# EAGLE design Hat V1 (EAGLE 9.3.2)
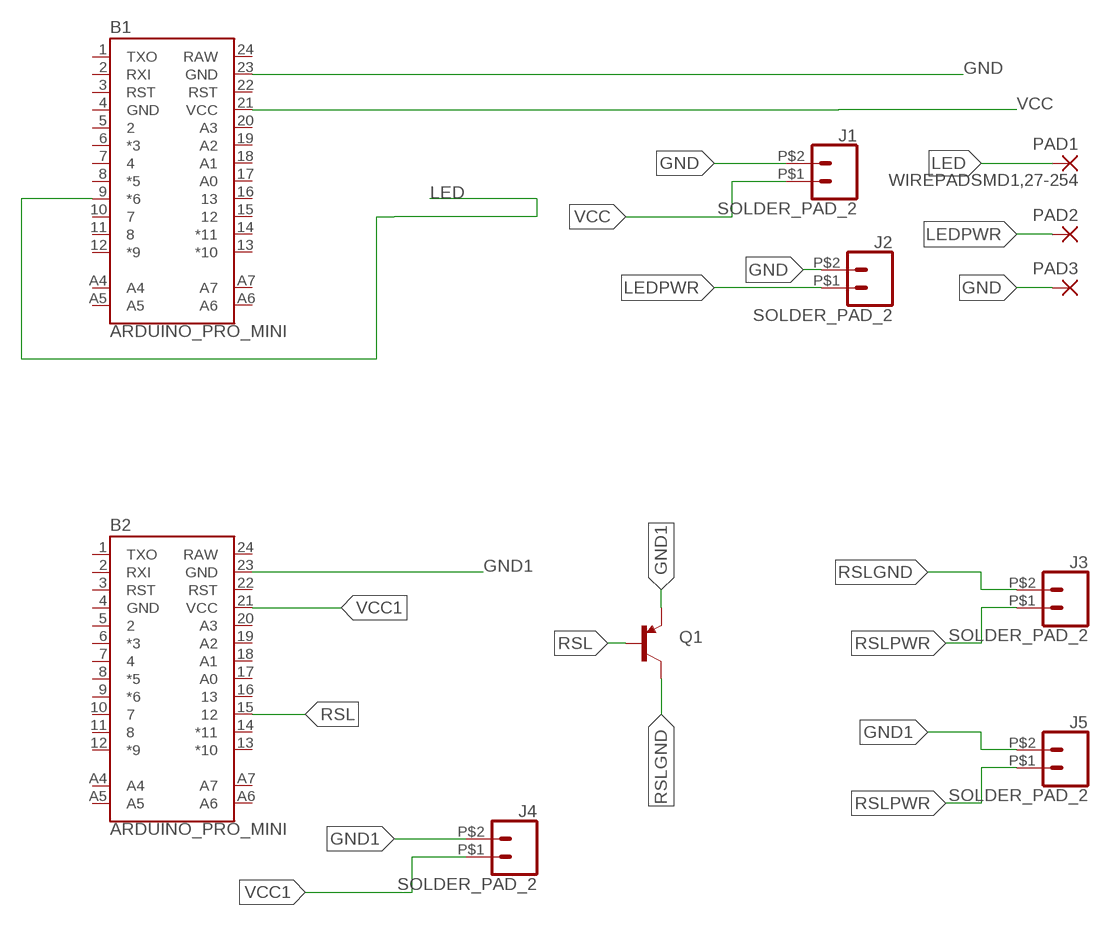
[diagram p0: schematic, sheet 1]

## Parts
B1  ARDUINO_PRO_MINI  [ARDUINO_PRO_MINI]
B2  ARDUINO_PRO_MINI  [ARDUINO_PRO_MINI]
J1  SOLDER_PAD_2  [SOLDER_PAD_2]
J2  SOLDER_PAD_2  [SOLDER_PAD_2]
J3  SOLDER_PAD_2  [SOLDER_PAD_2]
J4  SOLDER_PAD_2  [SOLDER_PAD_2]
J5  SOLDER_PAD_2  [SOLDER_PAD_2]
PAD1  WIREPADSMD1,27-254  [SMD1,27-2,54]
PAD2  SMD2  [SMD1,27-2,54]
PAD3  SMD2  [SMD1,27-2,54]
Q1  TRANSISTOR_PNPSMD-2  [SOT89]

## Nets
GND: B1.23(GND) J1.P$2 J2.P$2 PAD3.1(P)
GND1: B2.23(GND) J4.P$2 J5.P$2 Q1.3(E)
LED: B1.9(*6) PAD1.1(P)
LEDPWR: J2.P$1 PAD2.1(P)
RSL: B2.15 Q1.1(B)
RSLGND: J3.P$2 Q1.2(C)
RSLPWR: J3.P$1 J5.P$1
VCC: B1.21(VCC) J1.P$1
VCC1: B2.21(VCC) J4.P$1
Unconnected: B1.1(TXO) B1.2(RXI) B1.3(RST) B1.5 B1.6(*3) B1.7 B1.8(*5) B1.10 B1.11 B1.12(*9) B1.13(*10) B1.14(*11) B1.15 B1.16 B1.17(A0) B1.18(A1) B1.19(A2) B1.20(A3) B1.22(RST) B1.A4 B1.A5 B1.A6 B1.A7 B2.1(TXO) B2.2(RXI) B2.3(RST) B2.5 B2.6(*3) B2.7 B2.8(*5) B2.9(*6) B2.10 B2.11 B2.12(*9) B2.13(*10) B2.14(*11) B2.16 B2.17(A0) B2.18(A1) B2.19(A2) B2.20(A3) B2.22(RST) B2.A4 B2.A5 B2.A6 B2.A7

## Power pins joined to a net without a drawn wire
GND: B1.4(GND) B2.4(GND)
RAW: B1.24(RAW) B2.24(RAW)

## Library data of the parts
B1 B2 = SparkFun-Boards:ARDUINO_PRO_MINI: SparkFun Pro Mini Pro Mini compatible footprint. Dimensions: 0.7 x 1.3" PCB Thickness: 0.8mm SparkFun Products: 3.3V/8MHz <https://www.sparkfun.com/products/11114> 5V/16MHz <https://www.sparkfun.com/products/11113>
J1-J5 = SparkFun-Connectors:SOLDER_PAD_2: Solder Pad for LuMini Rings
PAD1 = wirepad:WIREPAD: Wire PAD connect wire on PCB
PAD2 PAD3 = wirepad:SMD2: SMD PAD
Q1 = User-Submitted:TRANSISTOR_PNP: Generic PNP BJT Double check pinouts against datasheets- not all devices are the same! MMBT3906 - 40V 200mA SOT-23 (TRANS-08052) MMBT4403 - 40V 600mA SOT-23 (TRANS-09245)

## Board
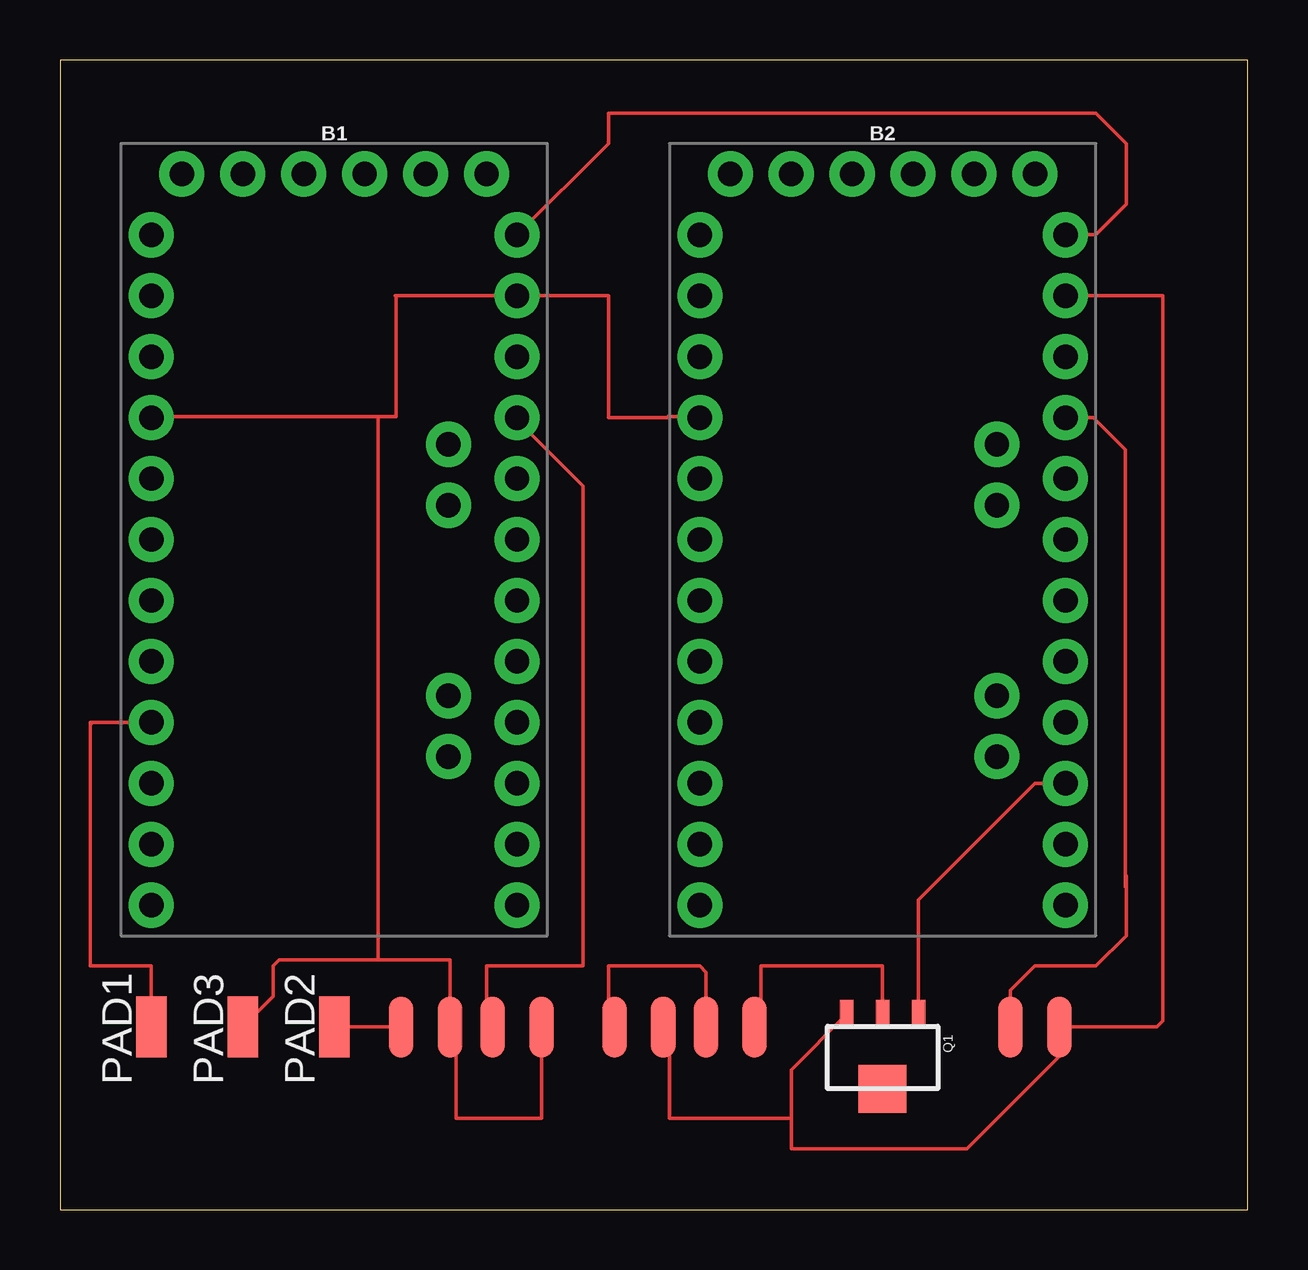
[diagram p1: board, top side]

Size 49.51 x 47.93 mm. Coordinates in mm from the lower left corner, seen from the top.
Outline: 0,0 49.51,0 49.51,47.93 0,47.93 0,0
Copper layers (1*16): Top 0.035mm / dielectric 1.5mm / Bottom 0.035mm
Design rules "default": minimum track width 6mil, minimum drill 0.35mm, track to track 6mil, track to pad 6mil, pad to pad 6mil, via to via 6mil, smd to smd 6mil, copper to edge 40mil, drill to drill 6mil, minimum pad ring 10mil, minimum via ring 8mil, stop-mask expansion 4mil, vias tented up to drill 0mil, thermal gap 10mil

### Footprints (pad centres in the part's own frame; a part is rotated, then mirrored left to right if it is on the bottom)
ARDUINO_PRO_MINI = drill 1.016 pad 1.88: 1 -7.62,12.7; 2 -7.62,10.16; 3 -7.62,7.62; 4 -7.62,5.08; 5 -7.62,2.54; 6 -7.62,0; 7 -7.62,-2.54; 8 -7.62,-5.08; 9 -7.62,-7.62; 10 -7.62,-10.16; 11 -7.62,-12.7; 12 -7.62,-15.24; 13 7.62,-15.24; 14 7.62,-12.7; 15 7.62,-10.16; 16 7.62,-7.62; 17 7.62,-5.08; 18 7.62,-2.54; 19 7.62,0; 20 7.62,2.54; 21 7.62,5.08; 22 7.62,7.62; 23 7.62,10.16; 24 7.62,12.7; A4 4.763,1.429; A5 4.763,3.969; A6 4.763,-9.049; A7 4.763,-6.509; BLK -6.35,15.24; GND -3.81,15.24; GRN 6.35,15.24; RXI 1.27,15.24; TXO 3.81,15.24; VCC -1.27,15.24
SOLDER_PAD_2 = smd 1.016 x 2.54: P$1 -1.016,0; P$2 1.016,0
SMD1,27-2,54 = smd 1.27 x 2.54: 1 0,0
SOT89 = smd 0.58 x 1.2: 1 -1.5,-1.8; 2 0,-1.8; 3 1.5,-1.8 | smd 2 x 2: 4 0,1.3

### Placement (x,y rotation side)
B1  11.43,27.94 0 top
B2  34.29,27.94 0 top
J1  19.05,7.62 0 top
J2  15.24,7.62 0 top
J3  27.94,7.62 0 top
J4  40.64,7.62 0 top
J5  24.13,7.62 0 top
PAD1  3.81,7.62 0 top
PAD2  11.43,7.62 0 top
PAD3  7.62,7.62 0 top
Q1  34.29,6.35 180 top

### Tracks (layer width: path | path; a pad name or v marks a point on that pad's centre or on a via)
GND
  Top 0.152: PAD3.1 8.89,8.89 8.89,10.16 9.14,10.41 13.26,10.41 | 13.26,10.41 16.26,10.41 J2.P$2 16.51,7.37 16.51,3.81 20.07,3.81 J1.P$2 | 13.26,33.07 14.02,33.07 14.02,38.05 13.97,38.1 B1.23 22.86,38.1 22.86,33.02 25.35,33.02 25.4,33.07 | 13.26,33.07 3.81,33.07 B1.4 | 25.35,33.07 25.4,33.07 | 25.4,33.07 26.67,33.07 B2.4 | 13.26,33.07 13.26,10.41
GND1
  Top 0.152: J4.P$2 41.66,6.4 37.8,2.54 30.48,2.54 30.48,3.81 | 41.76,7.62 J4.P$2 | Q1.3 30.48,5.84 30.48,3.81 | B2.23 45.97,38.1 45.97,7.87 45.72,7.62 J4.P$2 | J5.P$2 25.4,7.37 25.4,3.81 30.48,3.81
LED
  Top 0.152: PAD1.1 3.81,10.16 1.27,10.16 1.27,20.32 | 3.81,20.27 B1.9 1.27,20.32 | 1.27,20.32 1.32,20.27
LEDPWR
  Top 0.152: J2.P$1 PAD2.1
RAW
  Top 0.152: B1.24 22.86,44.45 22.86,45.72 43.18,45.72 44.45,44.45 44.45,41.91 43.18,40.64 B2.24
RSL
  Top 0.152: 41.91,17.68 B2.15 40.64,17.78 35.79,12.93 Q1.1
RSLGND
  Top 0.152: 34.29,8.13 Q1.2 34.29,10.16 29.21,10.16 29.21,7.87 J3.P$2
RSLPWR
  Top 0.152: J5.P$1 22.86,7.87 22.86,10.16 26.67,10.16 26.92,9.91 J3.P$1
VCC
  Top 0.152: B1.21 19.05,32.92 21.79,30.17 21.79,15.24 21.79,15.14 21.79,10.16 17.78,10.16 17.78,7.87 J1.P$1
VCC1
  Top 0.152: 39.62,8.69 J4.P$1 39.62,9.14 40.64,10.16 43.18,10.16 44.45,11.43 44.45,13.92 44.4,13.97 | 44.4,13.97 44.4,31.7 43.08,33.02 B2.21 | 44.4,13.97 44.4,13.46